# Altium project Temporizador_V7.PrjPcb
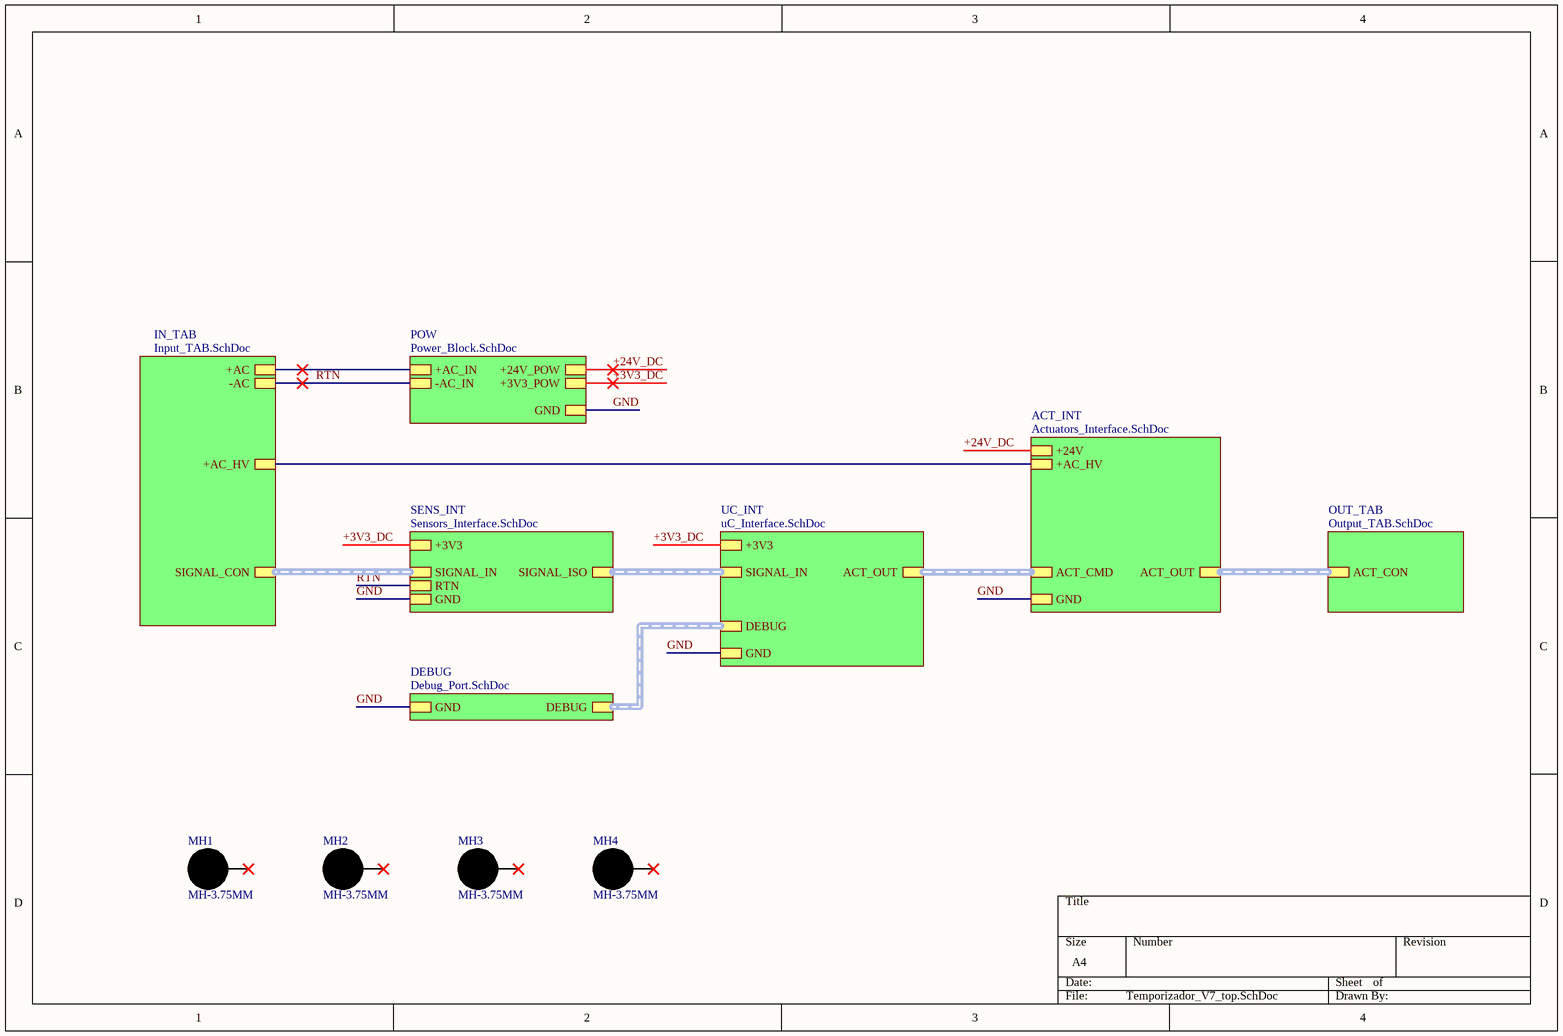
[diagram p0: Temporizador_V7_top.SchDoc]
9 sheets, 93 parts. Net scope: hierarchical (ports join the sheet entries above them; power ports are global).
Board file: TEMP007-1P-2O.PcbDoc
Sheets:
  Temporizador_V7_top.SchDoc
    POW = Power_Block.SchDoc
    ACT_INT = Actuators_Interface.SchDoc
    IN_TAB = Input_TAB.SchDoc
    OUT_TAB = Output_TAB.SchDoc
    SENS_INT = Sensors_Interface.SchDoc
      FAN = InputISO_Block.SchDoc
      HEAT = InputISO_Block.SchDoc
      LIMIT = InputISO_Block.SchDoc
      VALVE = InputISO_Block.SchDoc
      VACUUM = InputISO_Block.SchDoc
    UC_INT = uC_Interface.SchDoc
    DEBUG = Debug_Port.SchDoc

## Sheet Temporizador_V7_top.SchDoc
size A4; SheetNumber: 1; SheetTotal: 9

### Parts
MH1  MH-3.75MM  [MH-3.75mm-NP]
MH2  MH-3.75MM  [MH-3.75mm-NP]
MH3  MH-3.75MM  [MH-3.75mm-NP]
MH4  MH-3.75MM  [MH-3.75mm-NP]

### Sub-sheets
ACT_INT = Actuators_Interface.SchDoc: ACT_CMD (harness ACT_OUT), +24V, GND, +AC_HV, ACT_OUT (harness ACT_OUT)
DEBUG = Debug_Port.SchDoc: DEBUG (harness DEBUG), GND
IN_TAB = Input_TAB.SchDoc: +AC_HV, +AC, SIGNAL_CON (harness SIGNAL_BUS), -AC
OUT_TAB = Output_TAB.SchDoc: ACT_CON (harness ACT_OUT)
POW = Power_Block.SchDoc: +AC_IN, -AC_IN, +3V3_POW, +24V_POW, GND
SENS_INT = Sensors_Interface.SchDoc: SIGNAL_ISO (harness SIGNAL_BUS), SIGNAL_IN (harness SIGNAL_BUS), +3V3, GND, RTN
UC_INT = uC_Interface.SchDoc: SIGNAL_IN (harness SIGNAL_BUS), ACT_OUT (harness ACT_OUT), GND, +3V3, DEBUG (harness DEBUG)

### Nets
220V_AC: sheet ACT_INT/+AC_HV, sheet IN_TAB/+AC_HV
+3V3_DC: sheet POW/+3V3_POW, sheet SENS_INT/+3V3, sheet UC_INT/+3V3
+24V_DC: sheet POW/+24V_POW, sheet ACT_INT/+24V
GND: sheet POW/GND, sheet ACT_INT/GND, sheet SENS_INT/GND, sheet UC_INT/GND, sheet DEBUG/GND
RTN: sheet POW/-AC_IN, sheet IN_TAB/-AC, sheet SENS_INT/RTN
NetDB1_1: sheet POW/+AC_IN, sheet IN_TAB/+AC

Not connected (* = marked no-connect by the designer): MH1 1*; MH2 1*; MH3 1*; MH4 1*

### Buses and harness runs
harness sheet ACT_INT/ACT_CMD = sheet UC_INT/ACT_OUT
harness sheet ACT_INT/ACT_OUT = sheet OUT_TAB/ACT_CON
harness sheet DEBUG/DEBUG = sheet UC_INT/DEBUG
harness sheet IN_TAB/SIGNAL_CON = sheet SENS_INT/SIGNAL_IN
harness sheet SENS_INT/SIGNAL_ISO = sheet UC_INT/SIGNAL_IN

## Sheet Power_Block.SchDoc
size A4; SheetNumber: 2; SheetTotal: 9
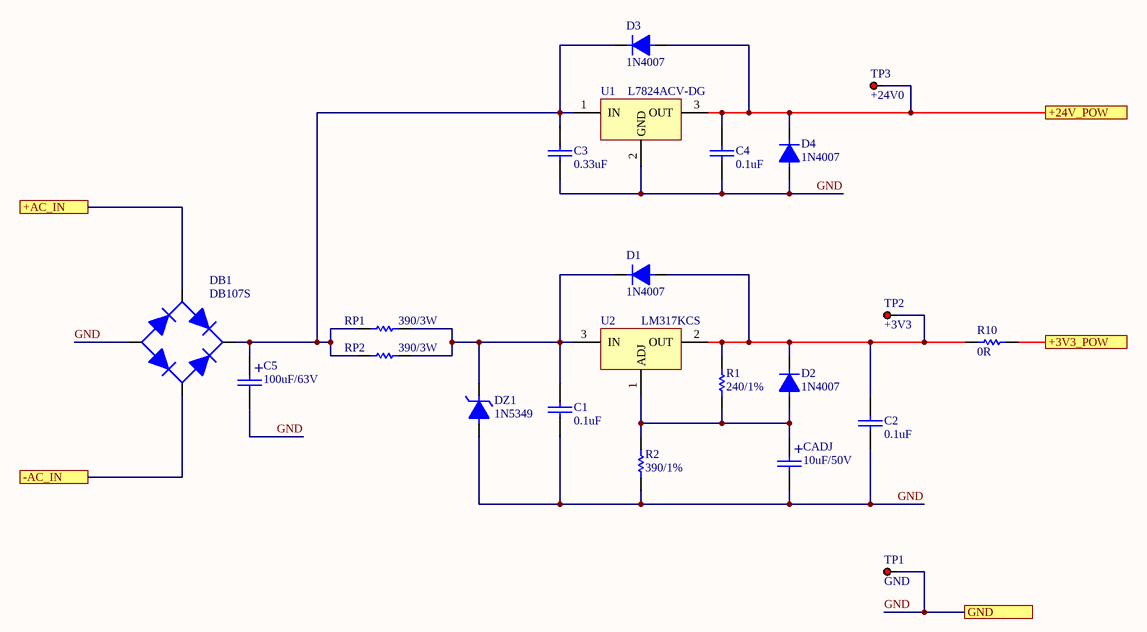
[diagram p1: Power_Block.SchDoc]

### Parts
(Parts that share a designator on the sheet are numbered #1, #2 ... from top to bottom, then left to right.)
C1#1  0.1uF  [1206-CAP-TDK]
C2#1  0.1uF  [1206-CAP-TDK]
C3  0.33uF  [CAP200]
C4  0.1uF  [1206-CAP-TDK]
C5  100uF/63V  [CAP200RP]
CADJ  10uF/50V  [CAP100RP]
D1#1  1N4007  [DO41]
D2#1  1N4007  [DO41]
D3  1N4007  [DO41]
D4  1N4007  [DO41]
DB1  DB107S  [DBS]
DZ1  1N5349  [DO40]
R1#1  240/1%  [RES400]
R2#1  390/1%  [RES400]
R10  0R  [1206-RES-PANASONIC]
RP1  390/3W  [RES1000 - NOSILK]
RP2  390/3W  [RES1000 - NOSILK]
TP1  GND  [TPTH - PAD TOP]  (no BOM)
TP2  +3V3  [TPTH - PAD TOP]  (no BOM)
TP3  +24V0  [TPTH - PAD TOP]  (no BOM)
U1#1  L7824ACV-DG  [TO-220 - DG - RA]
U2  LM317KCS  [TO-220 - KCS0003B - RA]

### Ports
+3V3_POW, +24V_POW, +AC_IN, -AC_IN, GND

### Nets
+3V3_DC: R10.2 ; port +3V3_POW
+24V_DC: C4.2 D3.1 D4.2 TP3.1 U1#1.3(OUT) ; port +24V_POW
GND: C1#1.1 C2#1.1 C3.1 C4.1 C5.2 CADJ.2 D4.1 DB1.4(-) DZ1.1 R2#1.1 TP1.1 U1#1.2(GND) ; port GND
RTN: DB1.3(AC-) ; port -AC_IN
NetC1#1_2: C1#1.2 D1#1.2 DZ1.2 RP1.2 RP2.2 U2.3(IN)
NetC2#1_2: C2#1.2 D1#1.1 D2#1.2 R1#1.2 R10.1 TP2.1 U2.2(OUT)
NetC3_2: C3.2 C5.1 D3.2 DB1.2(+) RP1.1 RP2.1 U1#1.1(IN)
NetCADJ_1: CADJ.1 D2#1.1 R1#1.1 R2#1.2 U2.1(ADJ)
NetDB1_1: DB1.1(AC+) ; port +AC_IN

### Notes on the sheet
- (in symbol CAPPOL-THT) +

### Library data of the parts
C1#1 C2#1 C4 = CAP-SMD: JLCPart: C24497
C3 = CAP-THT: JLCPart: C2761750
C5 CADJ = CAPPOL-THT
  C5: JLCPart: C165651
  CADJ: JLCPart: C2960372
D1#1 D2#1 D3 D4 = DIODE RECTIFIER: JLCPart: C3033995
DB1 = DB107S: Bridge Rectifier Single Phase Standard 1000 V Surface Mount 4-MiniDIP; JLCPart: C5377
DZ1 = DIODE ZENER: JLCPart: C232446
R1#1 R2#1 RP1 RP2 = RES-THT
  R1#1: JLCPart: C119310
  R2#1: JLCPart: C119315
  RP1 RP2: JLCPart: C348872
R10 = RES-SMD
TP1-TP3 = TP-PAD

## Sheet Actuators_Interface.SchDoc
size A4; SheetNumber: 6; SheetTotal: 9
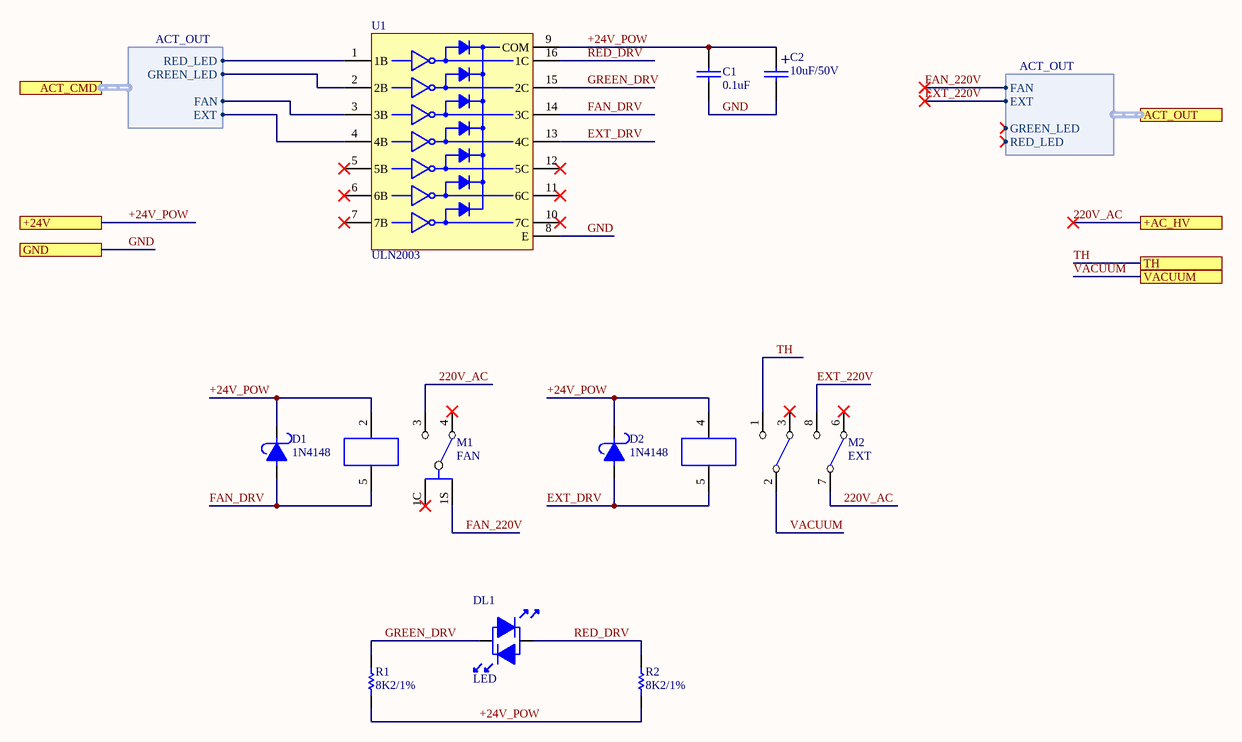
[diagram p2: Actuators_Interface.SchDoc]

### Parts
(Parts that share a designator on the sheet are numbered #1, #2 ... from top to bottom, then left to right.)
C1#2  0.1uF  [1206-CAP-TDK]
C2#2  10uF/50V  [CAP100RP]
D1#2  1N4148  [DO41]
D2#2  1N4148  [DO41]
DL1  LED  [LED-5MM - BI]
M1  FAN  [HJQ-15F-FORM-C]
M2  EXT  [TRA3-2-FORM-C]
R1#2  8K2/1%  [RES400]
R2#2  8K2/1%  [RES400]
U1#2  ULN2003  [DIP16]

### Ports
+24V, +AC_HV, ACT_CMD (harness ACT_OUT), ACT_OUT (harness ACT_OUT), GND, TH, VACUUM

### Harnesses
ACT_OUT: EXT, FAN, GREEN_LED, RED_LED

### Nets
220V_AC: M1.3(NA1) M2.7(C2) ; port +AC_HV
+24V_POW: C1#2.2 C2#2.1 D1#2.2 D2#2.2 M1.2(B1) M2.4(B1) R1#2.1 R2#2.1 U1#2.9(COM) ; port +24V  [project net +24V_DC]
EXT_220V: M2.8(NA2) ; port ACT_OUT.EXT
EXT_DRV: D2#2.1 M2.5(B2) U1#2.13(4C)
EXT_OUT: U1#2.4(4B) ; port ACT_CMD.EXT
FAN_220V: M1.1S(C1) ; port ACT_OUT.FAN
FAN_DRV: D1#2.1 M1.5(B2) U1#2.14(3C)
FAN_OUT: U1#2.3(3B) ; port ACT_CMD.FAN
GND: C1#2.1 C2#2.2 U1#2.8(E) ; port GND
GREEN_CTRL: U1#2.2(2B) ; port ACT_CMD.GREEN_LED
GREEN_DRV: DL1.1 R1#2.2 U1#2.15(2C)
RED_CTRL: U1#2.1(1B) ; port ACT_CMD.RED_LED
RED_DRV: DL1.2 R2#2.2 U1#2.16(1C)
TH: M2.1(NA1) ; port TH
VACUUM: M2.2(C1) ; port VACUUM

Not connected (* = marked no-connect by the designer): M1 1C(C1)* 4(NC1)*; M2 3(NC1)* 6(NC2)*; U1#2 5(5B)* 6(6B)* 7(7B)* 10(7C)* 11(6C)* 12(5C)*

### Notes on the sheet
- (in symbol CAPPOL-THT) +

### Library data of the parts
C1#2 = CAP-SMD: JLCPart: C24497
C2#2 = CAPPOL-THT: JLCPart: C2960372
D1#2 D2#2 = DIODE SCHOTTKY: JLCPart: C258182
DL1 = LED-BI
M1 = RELE SIMPLE M
M2 = RELE DOBLE
R1#2 R2#2 = RES-THT: JLCPart: C337170
U1#2 = ULN2003: JLCPart: C93000

## Sheet Input_TAB.SchDoc
size A4; SheetNumber: 7; SheetTotal: 9
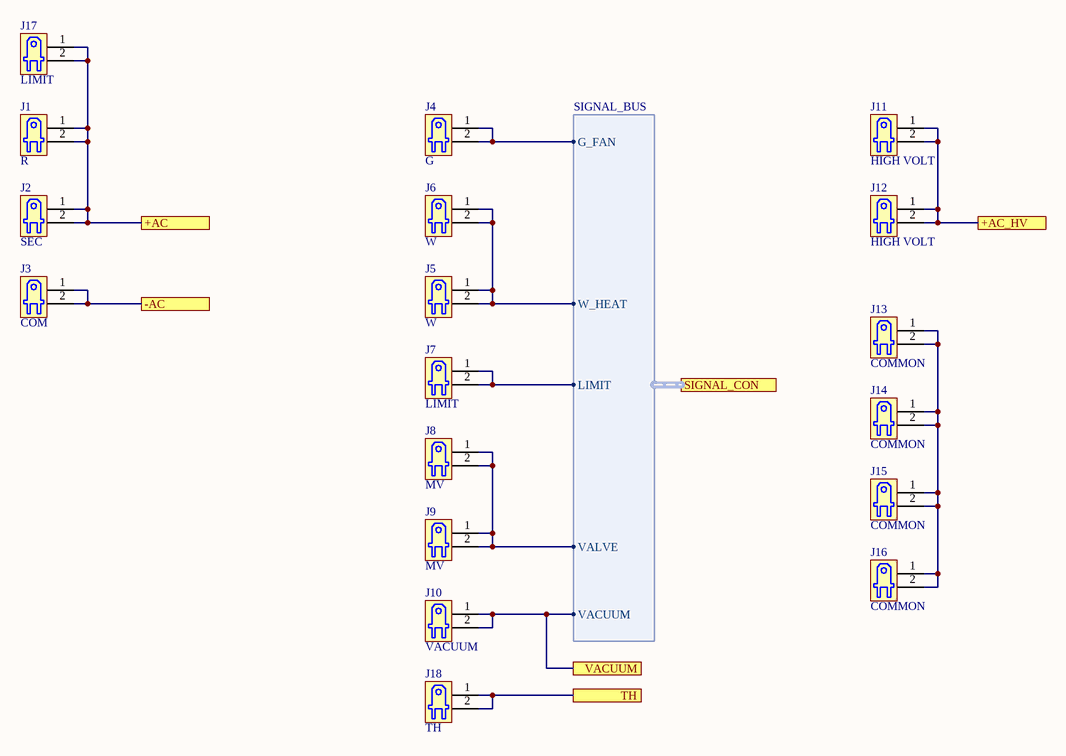
[diagram p3: Input_TAB.SchDoc]

### Parts
(Parts that share a designator on the sheet are numbered #1, #2 ... from top to bottom, then left to right.)
J1#1  R  [TAB250-250P]
J2#1  SEC  [TAB250-250P]
J3  COM  [TAB250-250P]
J4  G  [TAB250-250P]
J5  W  [TAB250-250P]
J6  W  [TAB250-250P]
J7  LIMIT  [TAB250-250P]
J8  MV  [TAB250-250P]
J9  MV  [TAB250-250P]
J10  VACUUM  [TAB250-250P]
J11  HIGH VOLT  [TAB250-250P]
J12  HIGH VOLT  [TAB250-250P]
J13  COMMON  [TAB250-250P]
J14  COMMON  [TAB250-250P]
J15  COMMON  [TAB250-250P]
J16  COMMON  [TAB250-250P]
J17  LIMIT  [TAB250-250P]
J18  TH  [TAB250-250P]

### Ports
+AC, +AC_HV, -AC, SIGNAL_CON (harness SIGNAL_BUS), TH, VACUUM

### Harnesses
SIGNAL_BUS: G_FAN, LIMIT, VACUUM, VALVE, W_HEAT

### Nets
220V_AC: J11.1 J11.2 J12.1 J12.2 ; port +AC_HV
G_IN: J4.1 J4.2 ; port SIGNAL_CON.G_FAN
LIMIT_IN: J7.1 J7.2 ; port SIGNAL_CON.LIMIT
RTN: J3.1 J3.2 ; port -AC
VACUUM_IN: J10.1 J10.2 ; port VACUUM, port SIGNAL_CON.VACUUM
VALVE_IN: J8.1 J8.2 J9.1 J9.2 ; port SIGNAL_CON.VALVE
W_IN: J5.1 J5.2 J6.1 J6.2 ; port SIGNAL_CON.W_HEAT
NetDB1_1: J1#1.1 J1#1.2 J2#1.1 J2#1.2 J17.1 J17.2 ; port +AC
NetJ13_1: J13.1 J13.2 J14.1 J14.2 J15.1 J15.2 J16.1 J16.2
NetJ18_1: J18.1 J18.2 ; port TH

### Library data of the parts
J1#1 J2#1 J3-J18 = TAB250

## Sheet Output_TAB.SchDoc
size A4; SheetNumber: 8; SheetTotal: 9
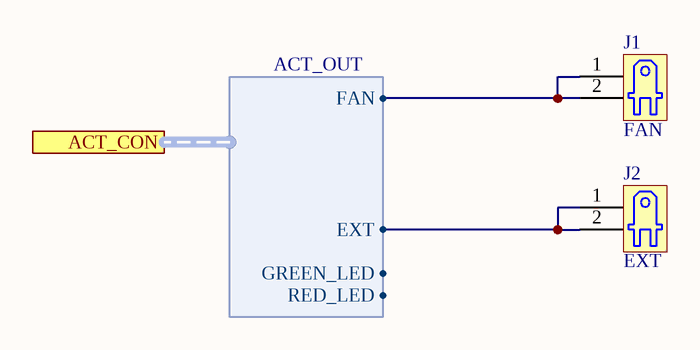
[diagram p4: Output_TAB.SchDoc]

### Parts
(Parts that share a designator on the sheet are numbered #1, #2 ... from top to bottom, then left to right.)
J1#2  FAN  [TAB250-250P]
J2#2  EXT  [TAB250-250P]

### Ports
ACT_CON (harness ACT_OUT)

### Harnesses
ACT_OUT: EXT, FAN, GREEN_LED, RED_LED

### Nets
EXT_220V: J2#2.1 J2#2.2 ; port ACT_CON.EXT
FAN_220V: J1#2.1 J1#2.2 ; port ACT_CON.FAN

### Library data of the parts
J1#2 J2#2 = TAB250

## Sheet Sensors_Interface.SchDoc
size A4; SheetNumber: 3; SheetTotal: 8
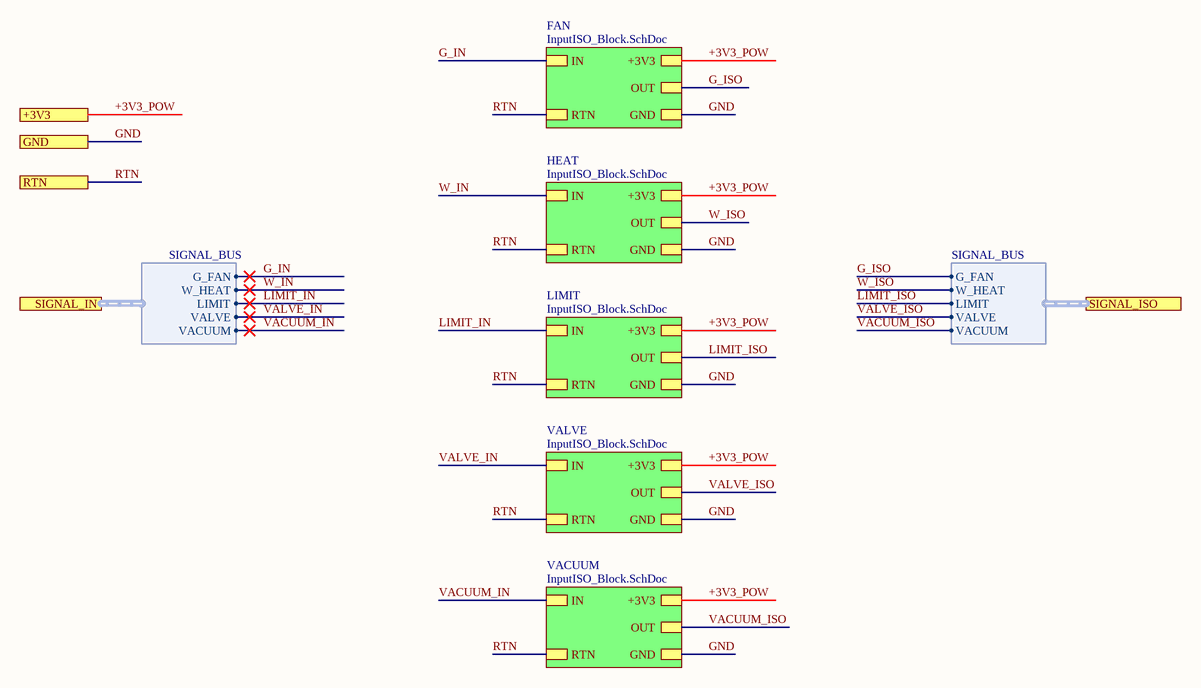
[diagram p5: Sensors_Interface.SchDoc]

### Sub-sheets
FAN = InputISO_Block.SchDoc: +3V3, OUT, IN, RTN, GND
HEAT = InputISO_Block.SchDoc: +3V3, OUT, IN, RTN, GND
LIMIT = InputISO_Block.SchDoc: +3V3, OUT, IN, RTN, GND
VACUUM = InputISO_Block.SchDoc: +3V3, OUT, IN, RTN, GND
VALVE = InputISO_Block.SchDoc: +3V3, OUT, IN, RTN, GND

### Ports
+3V3, GND, RTN, SIGNAL_IN (harness SIGNAL_BUS), SIGNAL_ISO (harness SIGNAL_BUS)

### Harnesses
SIGNAL_BUS: G_FAN, W_HEAT, LIMIT, VACUUM, VALVE
SIGNAL_BUS: G_FAN, LIMIT, VACUUM, VALVE, W_HEAT

### Nets
+3V3_POW: port +3V3, sheet FAN/+3V3, sheet HEAT/+3V3, sheet LIMIT/+3V3, sheet VALVE/+3V3, sheet VACUUM/+3V3  [project net +3V3_DC]
G_IN: sheet FAN/IN, port SIGNAL_IN.G_FAN
G_ISO: sheet FAN/OUT, port SIGNAL_ISO.G_FAN  [project net G_DIG]
GND: port GND, sheet FAN/GND, sheet HEAT/GND, sheet LIMIT/GND, sheet VALVE/GND, sheet VACUUM/GND
LIMIT_IN: sheet LIMIT/IN, port SIGNAL_IN.LIMIT
LIMIT_ISO: sheet LIMIT/OUT, port SIGNAL_ISO.LIMIT  [project net LIMIT_DIG]
RTN: port RTN, sheet FAN/RTN, sheet HEAT/RTN, sheet LIMIT/RTN, sheet VALVE/RTN, sheet VACUUM/RTN
VACUUM_IN: sheet VACUUM/IN, port SIGNAL_IN.VACUUM
VACUUM_ISO: sheet VACUUM/OUT, port SIGNAL_ISO.VACUUM  [project net VACUUM_DIG]
VALVE_IN: sheet VALVE/IN, port SIGNAL_IN.VALVE
VALVE_ISO: sheet VALVE/OUT, port SIGNAL_ISO.VALVE  [project net VALVE_DIG]
W_IN: sheet HEAT/IN, port SIGNAL_IN.W_HEAT
W_ISO: sheet HEAT/OUT, port SIGNAL_ISO.W_HEAT  [project net W_DIG]

## Sheet InputISO_Block.SchDoc
size A4; SheetNumber: 4; SheetTotal: 9
Used 5 times, as channels SENS_INT/FAN, SENS_INT/HEAT, SENS_INT/LIMIT, SENS_INT/VALVE, SENS_INT/VACUUM. Parts and nets are listed once, with the designators drawn on the sheet.
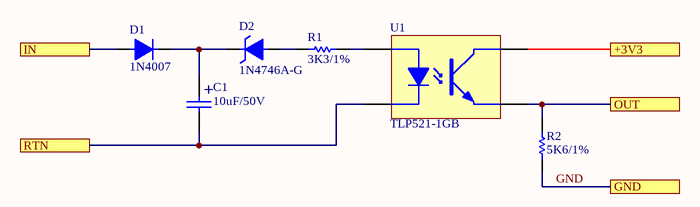
[diagram p6: InputISO_Block.SchDoc]

### Parts
C1  10uF/50V  [CAP100RP]
D1  1N4007  [DO41]
D2  1N4746A-G  [DO40]
R1  3K3/1%  [RES400]
R2  5K6/1%  [RES400]
U1  TLP521-1GB  [DIP4]

### Ports
+3V3, GND, IN, OUT, RTN

### Nets
+3V3: U1.4(C) ; port +3V3
GND: R2.1 ; port GND
IN: D1.1 ; port IN
OUT: R2.2 U1.3(E) ; port OUT
RTN: C1.2 U1.2(K) ; port RTN
NetC1_1: C1.1 D1.2 D2.2
NetD2_1: D2.1 R1.1
NetR1_2: R1.2 U1.1(A)

### Channels
SENS_INT/FAN: designators end in _FAN; ports +3V3=+3V3_DC GND=GND IN=G_IN OUT=G_DIG RTN=RTN
SENS_INT/HEAT: designators end in _HEAT; ports +3V3=+3V3_DC GND=GND IN=W_IN OUT=W_DIG RTN=RTN
SENS_INT/LIMIT: designators end in _LIMIT; ports +3V3=+3V3_DC GND=GND IN=LIMIT_IN OUT=LIMIT_DIG RTN=RTN
SENS_INT/VALVE: designators end in _VALVE; ports +3V3=+3V3_DC GND=GND IN=VALVE_IN OUT=VALVE_DIG RTN=RTN
SENS_INT/VACUUM: designators end in _VACUUM; ports +3V3=+3V3_DC GND=GND IN=VACUUM_IN OUT=VACUUM_DIG RTN=RTN

### Notes on the sheet
- (in symbol CAPPOL-THT) +

### Library data of the parts
C1 = CAPPOL-THT: JLCPart: C2960372
D1 = DIODE RECTIFIER: JLCPart: C3033995
D2 = DIODE ZENER: JLCPart: C391338
R1 R2 = RES-THT
  R1: JLCPart: C119335
  R2: JLCPart: C173035
U1 = TLP521-1: JLCPart: C69256

## Sheet uC_Interface.SchDoc
size A4; SheetNumber: 5; SheetTotal: 9
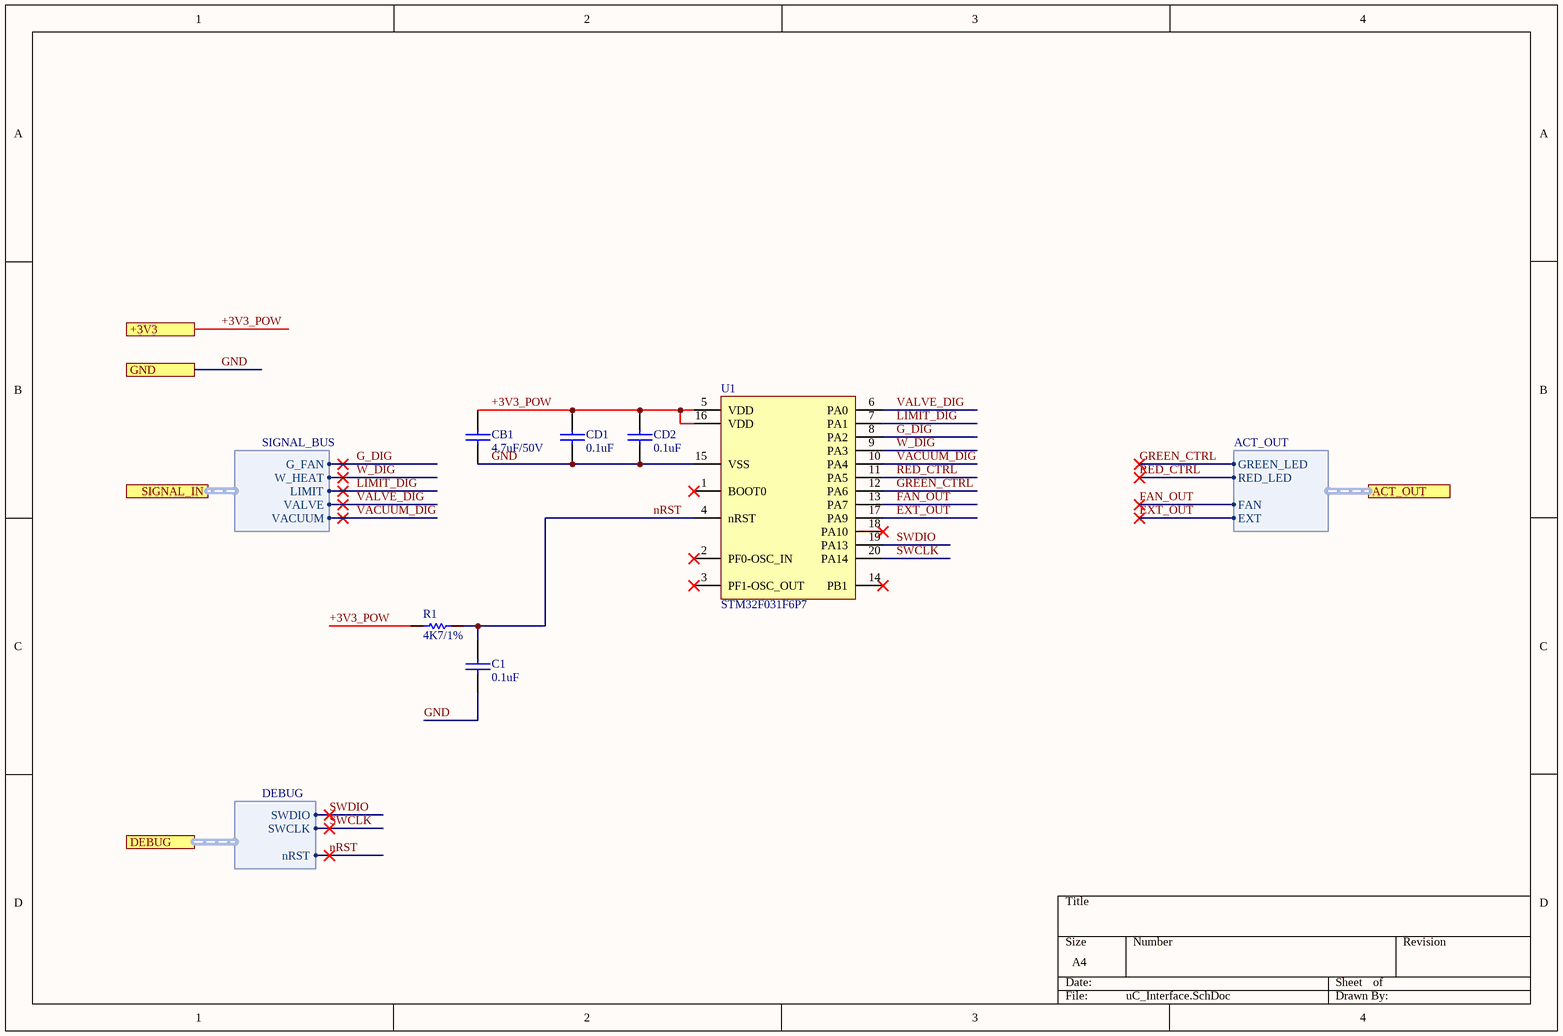
[diagram p7: uC_Interface.SchDoc]

### Parts
(Parts that share a designator on the sheet are numbered #1, #2 ... from top to bottom, then left to right.)
C1#3  0.1uF  [1206-CAP-TDK]
CB1  4.7uF/50V  [1206-CAP-TDK]
CD1  0.1uF  [1206-CAP-TDK]
CD2  0.1uF  [1206-CAP-TDK]
R1#3  4K7/1%  [1206-RES-PANASONIC]
U1#3  STM32F031F6P7  [ST-TSSOP-20 - STM32F031F6P7]

### Ports
+3V3, ACT_OUT (harness ACT_OUT), DEBUG (harness DEBUG), GND, SIGNAL_IN (harness SIGNAL_BUS)

### Harnesses
SIGNAL_BUS: G_FAN, LIMIT, VACUUM, VALVE, W_HEAT
ACT_OUT: GREEN_LED, RED_LED, FAN, EXT
DEBUG: SWDIO, SWCLK, nRST

### Nets
+3V3_POW: CB1.2 CD1.2 CD2.2 R1#3.1 U1#3.5(VDD) U1#3.16(VDD) ; port +3V3  [project net +3V3_DC]
EXT_OUT: U1#3.17(PA9) ; port ACT_OUT.EXT
FAN_OUT: U1#3.13(PA7) ; port ACT_OUT.FAN
G_DIG: U1#3.8(PA2) ; port SIGNAL_IN.G_FAN
GND: C1#3.1 CB1.1 CD1.1 CD2.1 U1#3.15(VSS) ; port GND
GREEN_CTRL: U1#3.12(PA6) ; port ACT_OUT.GREEN_LED
LIMIT_DIG: U1#3.7(PA1) ; port SIGNAL_IN.LIMIT
nRST: C1#3.2 R1#3.2 U1#3.4(nRST) ; port DEBUG.nRST
RED_CTRL: U1#3.11(PA5) ; port ACT_OUT.RED_LED
SWCLK: U1#3.20(PA14) ; port DEBUG.SWCLK
SWDIO: U1#3.19(PA13) ; port DEBUG.SWDIO
VACUUM_DIG: U1#3.10(PA4) ; port SIGNAL_IN.VACUUM
VALVE_DIG: U1#3.6(PA0) ; port SIGNAL_IN.VALVE
W_DIG: U1#3.9(PA3) ; port SIGNAL_IN.W_HEAT

Not connected (* = marked no-connect by the designer): U1#3 1(BOOT0)* 2(PF0-OSC_IN)* 3(PF1-OSC_OUT)* 14(PB1)* 18(PA10)*

### Library data of the parts
C1#3 CB1 CD1 CD2 = CAP-SMD
  C1#3 CD1 CD2: JLCPart: C24497
  CB1: JLCPart: C29823
R1#3 = RES-SMD: JLCPart: C17936
U1#3 = STM32F031F6P7: ARM® Cortex®-M0 STM32F0 Microcontroller IC 32-Bit Single-Core 48MHz 32KB (32K x 8) FLASH 20-TSSOP; JLCPart: C117472

## Sheet Debug_Port.SchDoc
size A4; SheetNumber: 9; SheetTotal: 9
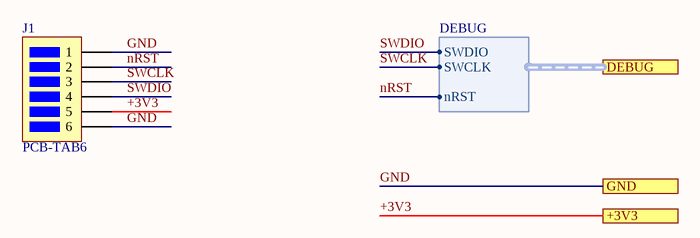
[diagram p8: Debug_Port.SchDoc]

### Parts
(Parts that share a designator on the sheet are numbered #1, #2 ... from top to bottom, then left to right.)
J1#3  PCB-TAB6  [PCB-TAB6]

### Ports
+3V3, DEBUG (harness DEBUG), GND

### Harnesses
DEBUG: nRST, SWCLK, SWDIO

### Nets
+3V3: J1#3.5 ; port +3V3
GND: J1#3.1 J1#3.6 ; port GND
nRST: J1#3.2 ; port DEBUG.nRST
SWCLK: J1#3.3 ; port DEBUG.SWCLK
SWDIO: J1#3.4 ; port DEBUG.SWDIO

## Nets that join several sheets
220V_AC: Actuators_Interface (M1.3 M2.7), Input_TAB (J11.1 J11.2 J12.1 J12.2)
+3V3_DC: Power_Block (R10.2), SENS_INT/FAN (U1_FAN.4), SENS_INT/HEAT (U1_HEAT.4), SENS_INT/LIMIT (U1_LIMIT.4), SENS_INT/VALVE (U1_VALVE.4), SENS_INT/VACUUM (U1_VACUUM.4), uC_Interface (6 pins)
+24V_DC: Power_Block (5 pins), Actuators_Interface (9 pins)
EXT_220V: Actuators_Interface (M2.8), Output_TAB (J2#2.1 J2#2.2)
EXT_OUT: Actuators_Interface (U1#2.4), uC_Interface (U1#3.17)
FAN_220V: Actuators_Interface (M1.1S), Output_TAB (J1#2.1 J1#2.2)
FAN_OUT: Actuators_Interface (U1#2.3), uC_Interface (U1#3.13)
G_DIG: SENS_INT/FAN (R2_FAN.2 U1_FAN.3), uC_Interface (U1#3.8)
G_IN: Input_TAB (J4.1 J4.2), SENS_INT/FAN (D1_FAN.1)
GND: Power_Block (12 pins), Actuators_Interface (C1#2.1 C2#2.2 U1#2.8), SENS_INT/FAN (R2_FAN.1), SENS_INT/HEAT (R2_HEAT.1), SENS_INT/LIMIT (R2_LIMIT.1), SENS_INT/VALVE (R2_VALVE.1), SENS_INT/VACUUM (R2_VACUUM.1), uC_Interface (5 pins), Debug_Port (J1#3.1 J1#3.6)
GREEN_CTRL: Actuators_Interface (U1#2.2), uC_Interface (U1#3.12)
LIMIT_DIG: SENS_INT/LIMIT (R2_LIMIT.2 U1_LIMIT.3), uC_Interface (U1#3.7)
LIMIT_IN: Input_TAB (J7.1 J7.2), SENS_INT/LIMIT (D1_LIMIT.1)
NetDB1_1: Power_Block (DB1.1), Input_TAB (6 pins)
nRST: uC_Interface (C1#3.2 R1#3.2 U1#3.4), Debug_Port (J1#3.2)
RED_CTRL: Actuators_Interface (U1#2.1), uC_Interface (U1#3.11)
RTN: Power_Block (DB1.3), Input_TAB (J3.1 J3.2), SENS_INT/FAN (C1_FAN.2 U1_FAN.2), SENS_INT/HEAT (C1_HEAT.2 U1_HEAT.2), SENS_INT/LIMIT (C1_LIMIT.2 U1_LIMIT.2), SENS_INT/VALVE (C1_VALVE.2 U1_VALVE.2), SENS_INT/VACUUM (C1_VACUUM.2 U1_VACUUM.2)
SWCLK: uC_Interface (U1#3.20), Debug_Port (J1#3.3)
SWDIO: uC_Interface (U1#3.19), Debug_Port (J1#3.4)
VACUUM_DIG: SENS_INT/VACUUM (R2_VACUUM.2 U1_VACUUM.3), uC_Interface (U1#3.10)
VACUUM_IN: Input_TAB (J10.1 J10.2), SENS_INT/VACUUM (D1_VACUUM.1)
VALVE_DIG: SENS_INT/VALVE (R2_VALVE.2 U1_VALVE.3), uC_Interface (U1#3.6)
VALVE_IN: Input_TAB (J8.1 J8.2 J9.1 J9.2), SENS_INT/VALVE (D1_VALVE.1)
W_DIG: SENS_INT/HEAT (R2_HEAT.2 U1_HEAT.3), uC_Interface (U1#3.9)
W_IN: Input_TAB (J5.1 J5.2 J6.1 J6.2), SENS_INT/HEAT (D1_HEAT.1)

## Assembly variants
For Assembly: all parts fitted